# Altium project CM4-Tower.PrjPcb (part 4 of 4)

## Sheet 07_USB_Type-C_DFP_DP_ALT.SchDoc: USB-C Connectors
size A2; Organization: Greenfield Tech Solutions; Address1: Molendreef 33; Address2: Ossendrecht; Address3: 4641CS; Address4: The Netherlands; Revision: 1.1; SheetNumber: 7; SheetTotal: 11
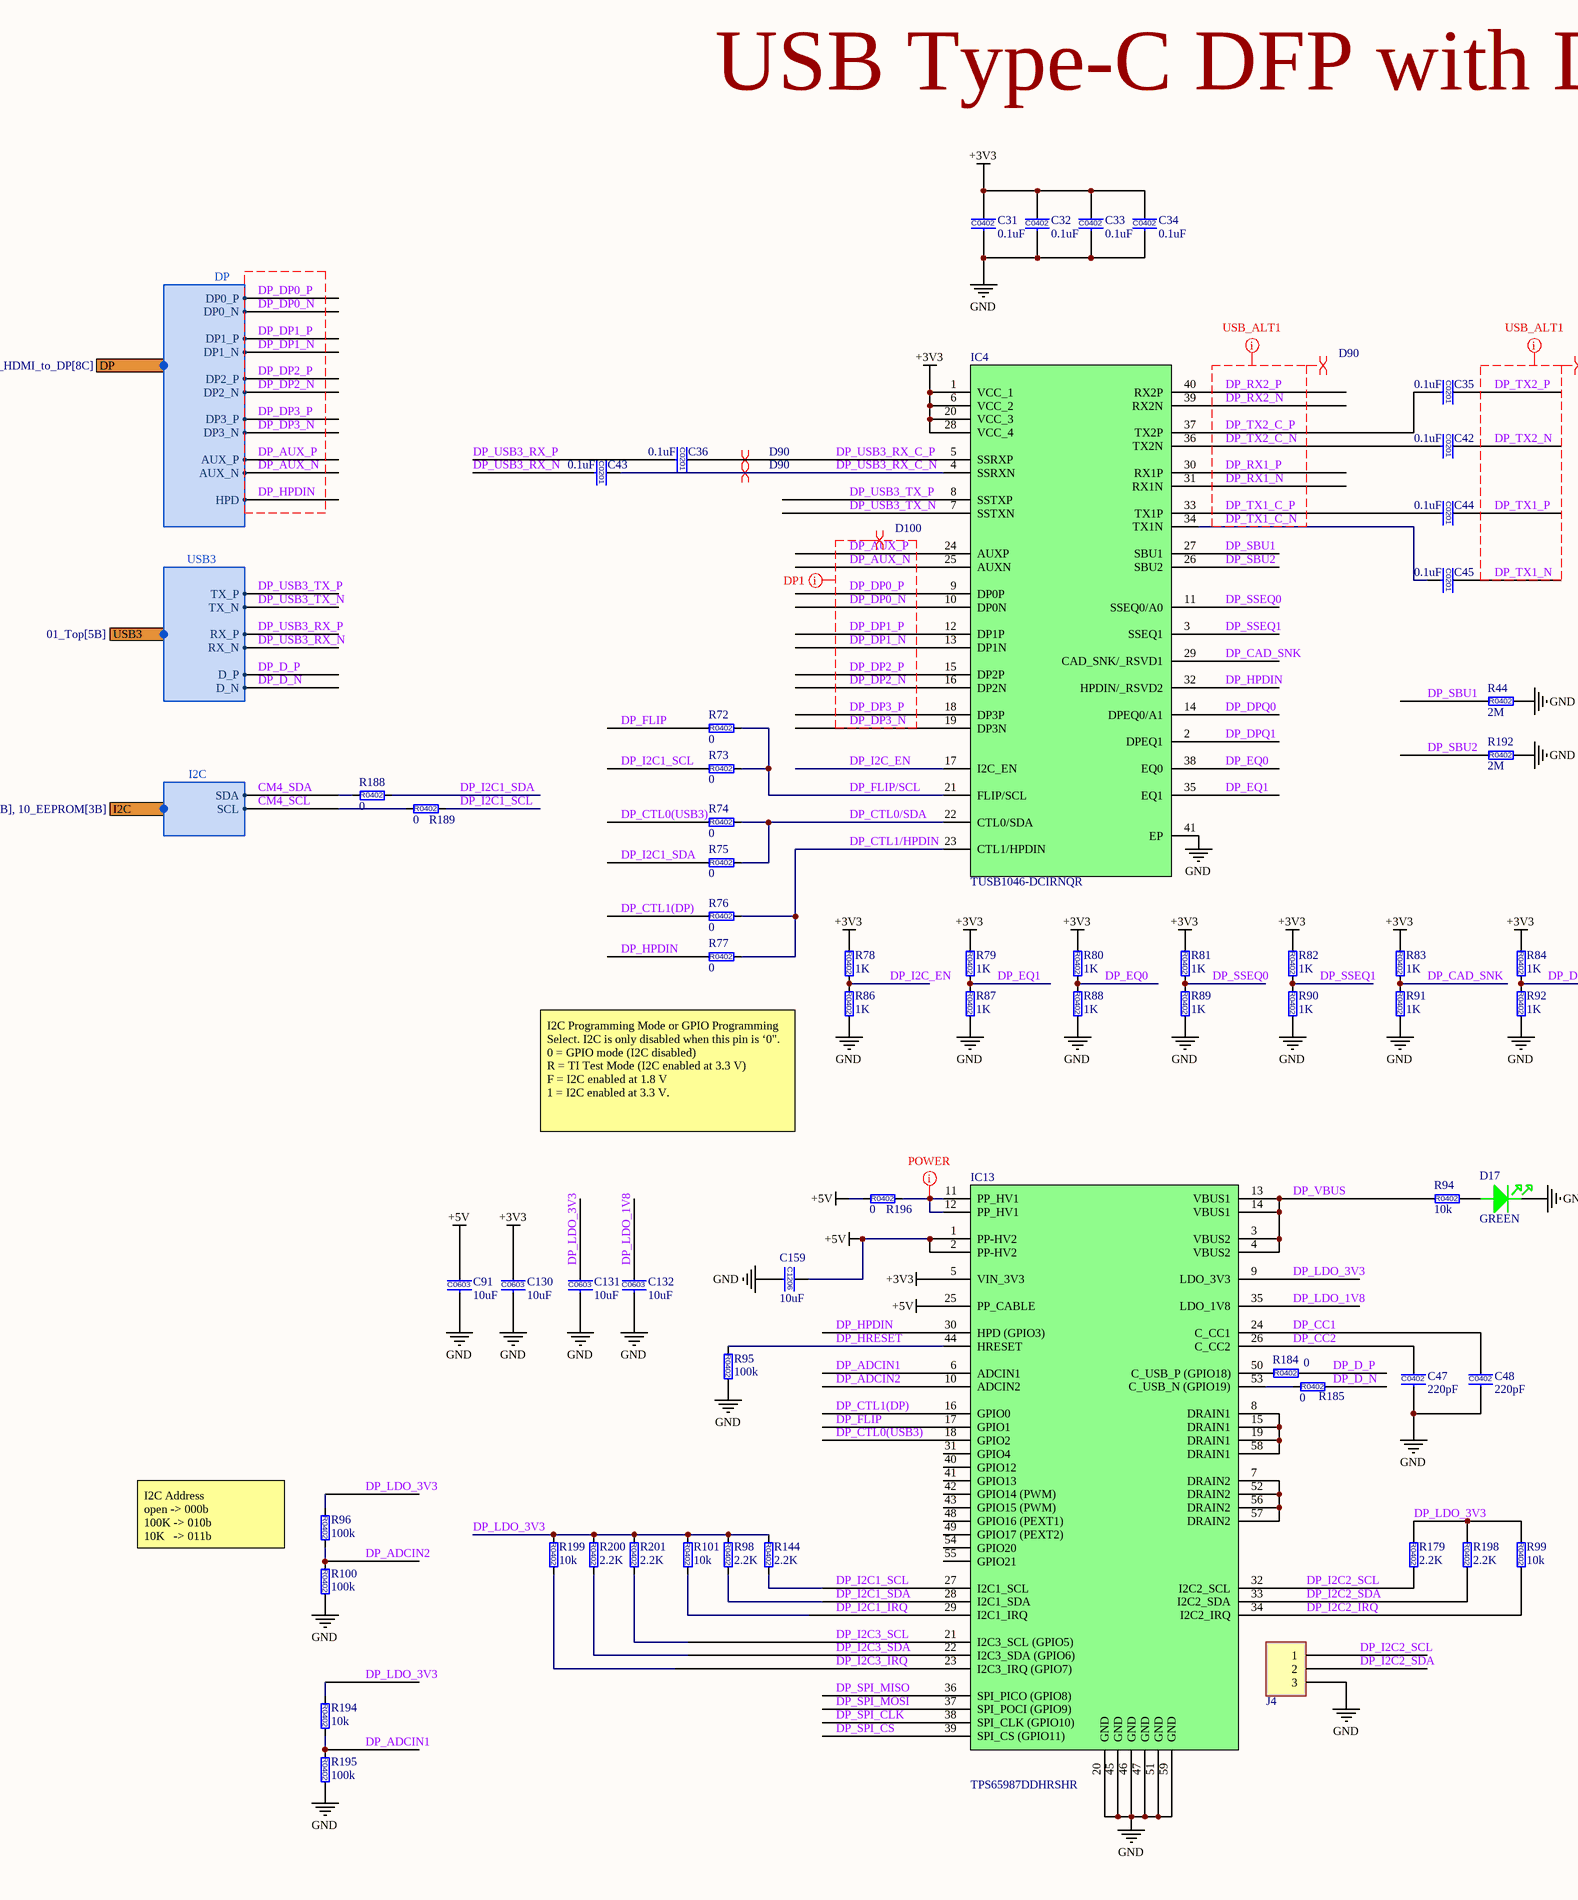
[diagram p12: 07_USB_Type-C_DFP_DP_ALT.SchDoc, left]
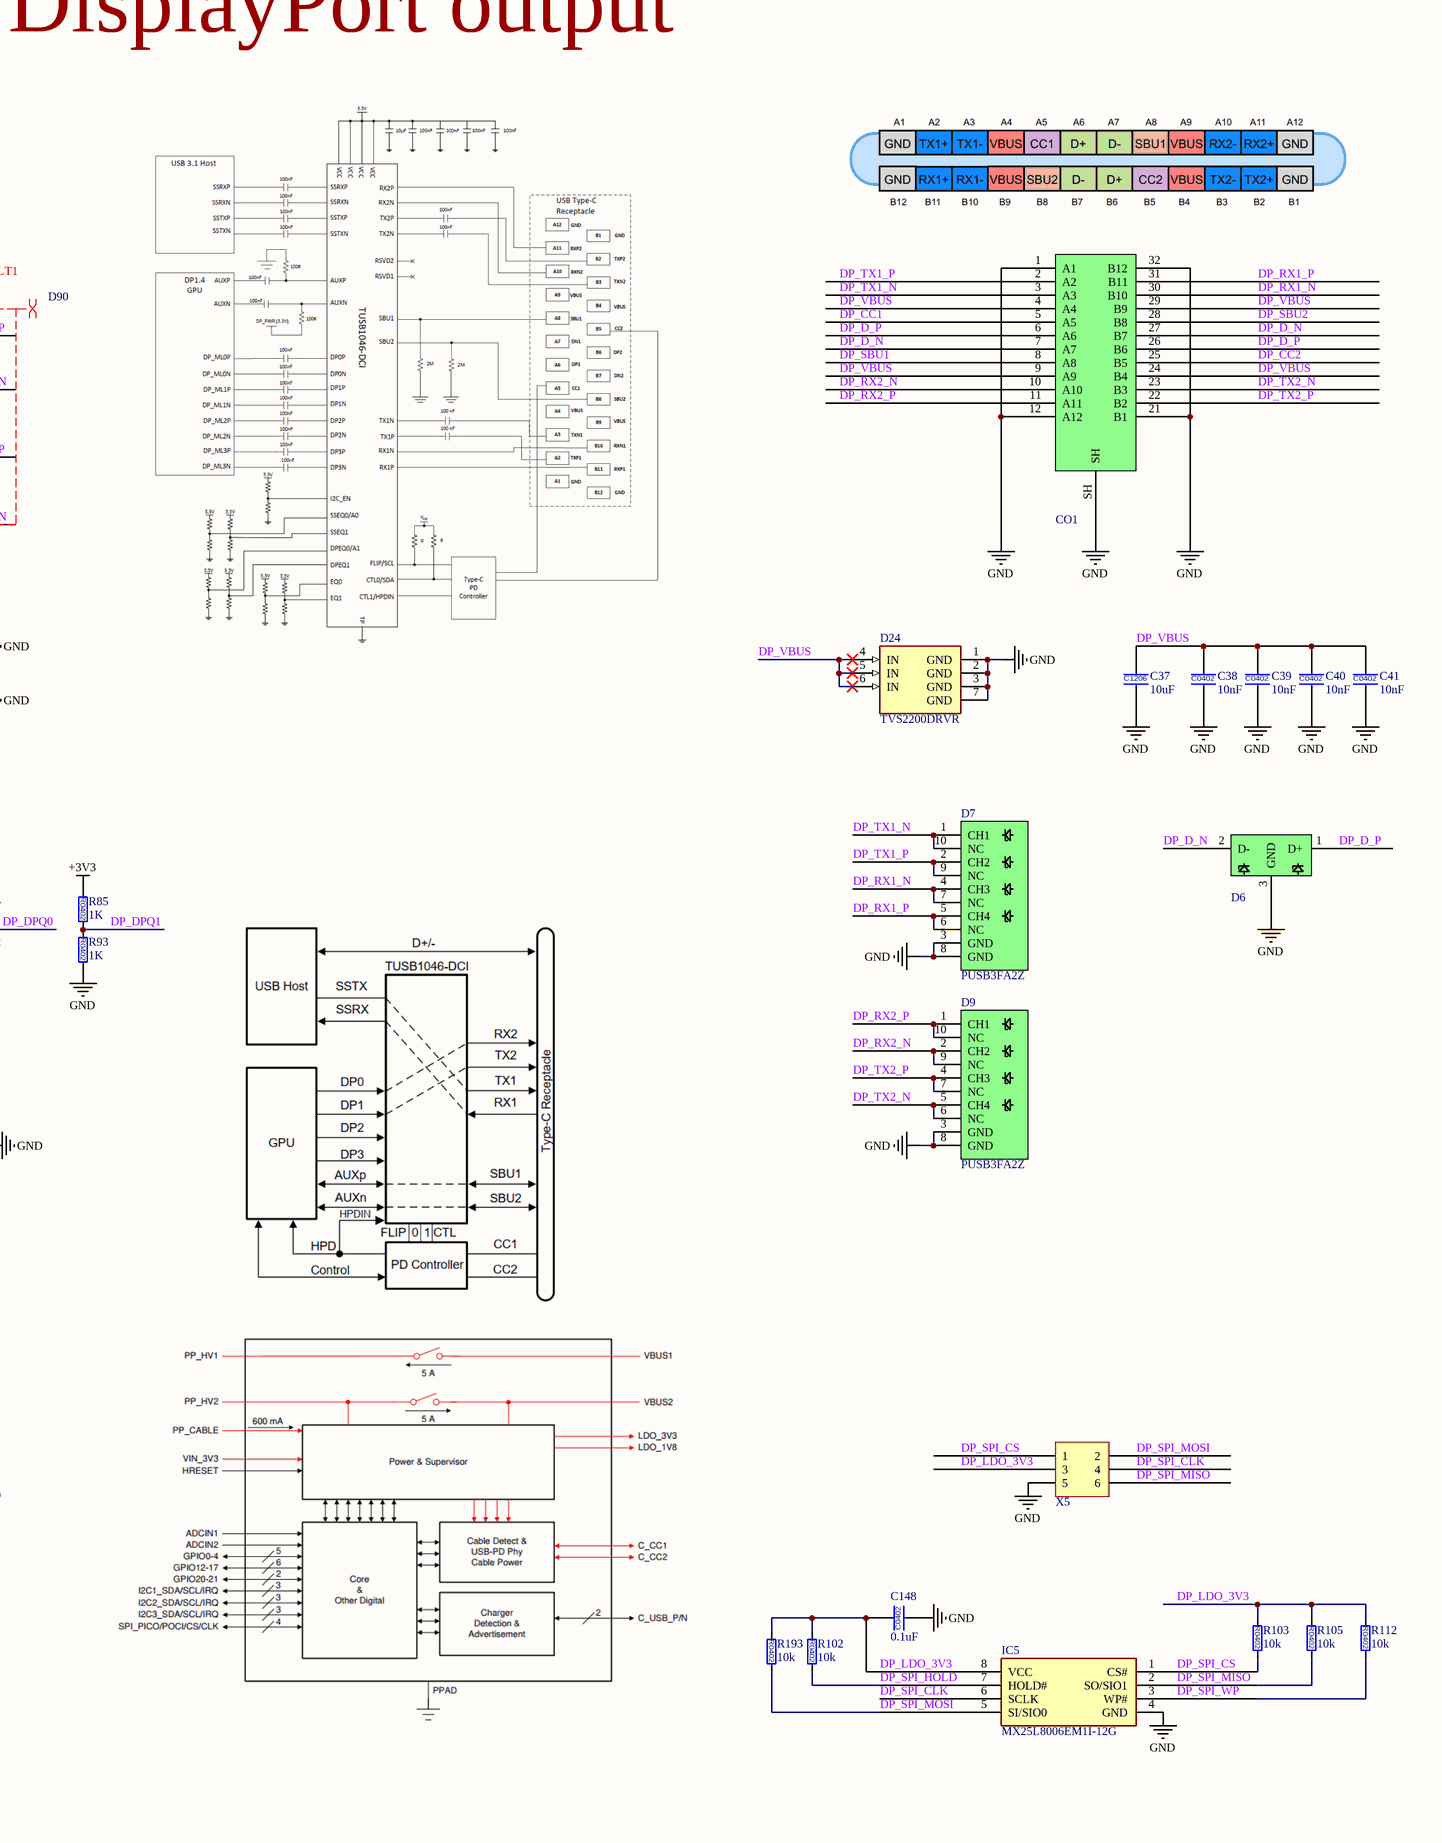
[diagram p13: 07_USB_Type-C_DFP_DP_ALT.SchDoc, right]

### Parts
C31  0.1uF  [C0402]
C32  0.1uF  [C0402]
C33  0.1uF  [C0402]
C34  0.1uF  [C0402]
C35  0.1uF  [C0201]
C36  0.1uF  [C0201]
C37  10uF  [C1206]
C38  10nF  [C0402]
C39  10nF  [C0402]
C40  10nF  [C0402]
C41  10nF  [C0402]
C42  0.1uF  [C0201]
C43  0.1uF  [C0201]
C44  0.1uF  [C0201]
C45  0.1uF  [C0201]
C47  220pF  [C0402]
C48  220pF  [C0402]
C91  10uF  [C0603]
C130  10uF  [C0603]
C131  10uF  [C0603]
C132  10uF  [C0603]
C148  0.1uF  [C0402]
C159  10uF  [C1206]
CO1  USB4070-30-C  [USB4070-30-C]  (value not drawn)
D6  TPD2EUSB30DRTR  [TPD2EUSB30DRTR_SOT-3]  (value not drawn)
D7  PUSB3FA2Z  [PUSB3FA2Z_DFN_2510_10]
D9  PUSB3FA2Z  [PUSB3FA2Z_DFN_2510_10]
D17  GREEN  [LED_0603]
D24  TVS2200DRVR  [TVS2200D_SON_6]
IC4  TUSB1046-DCIRNQR  [TUSB1046_WQFN_40]
IC5  MX25L8006EM1I-12G  [SOIC127P600X175-8N]
IC13  TPS65987DDHRSHR  [TPS65987D_VQFN-56]
J4  PLS-3  [PLS-3-3D]  (value not drawn)
R44  2M  [R0402]
R72  0  [R0402]
R73  0  [R0402]
R74  0  [R0402]
R75  0  [R0402]
R76  0  [R0402]
R77  0  [R0402]
R78  1K  [R0402]
R79  1K  [R0402]
R80  1K  [R0402]
R81  1K  [R0402]
R82  1K  [R0402]
R83  1K  [R0402]
R84  1K  [R0402]
R85  1K  [R0402]
R86  1K  [R0402]
R87  1K  [R0402]
R88  1K  [R0402]
R89  1K  [R0402]
R90  1K  [R0402]
R91  1K  [R0402]
R92  1K  [R0402]
R93  1K  [R0402]
R94  10k  [R0402]
R95  100k  [R0402]
R96  100k  [R0402]
R98  2.2K  [R0402]
R99  10k  [R0402]
R100  100k  [R0402]
R101  10k  [R0402]
R102  10k  [R0402]
R103  10k  [R0402]
R105  10k  [R0402]
R112  10k  [R0402]
R144  2.2K  [R0402]
R179  2.2K  [R0402]
R184  0  [R0402]
R185  0  [R0402]
R188  0  [R0402]
R189  0  [R0402]
R192  2M  [R0402]
R193  10k  [R0402]
R194  10k  [R0402]
R195  100k  [R0402]
R196  0  [R0402]
R198  2.2K  [R0402]
R199  10k  [R0402]
R200  2.2K  [R0402]
R201  2.2K  [R0402]
X5  PBD-6  [PXD-6]  (value not drawn)

### Ports
DP (harness DP, see 01_Top[4B], 05_HDMI_to_DP[8C]), I2C (harness I2C, see 01_Top[4B], 03_RPiCM4[1B], 05_HDMI_to_DP[1B], 06_USB_Type-C_DFP[1B], 08_USB_Type-C_DFP_DP_ALT_buttom[1B], 09_RTC[3B], 10_EEPROM[3B]), USB3 (harness USB3, see 01_Top[5B])

### Harnesses
USB3: TX_P, TX_N, RX_P, RX_N, D_P, D_N
I2C: SDA, SCL
DP: DP0_P, DP1_P, DP1_N, DP0_N, DP3_P, DP3_N, DP2_P, DP2_N, AUX_P, AUX_N, HPD

### Nets
+3V3: C31.1 C32.1 C33.1 C34.1 C130.1 IC4.1(VCC_1) IC4.6(VCC_2) IC4.20(VCC_3) IC4.28(VCC_4) IC13.5(VIN_3V3) R78.1 R79.1 R80.1 R81.1 R82.1 R83.1 R84.1 R85.1
+5V: C91.1 C159.1 IC13.1(PP-HV2) IC13.2(PP-HV2) IC13.25(PP_CABLE) R196.1
GND: C31.2 C32.2 C33.2 C34.2 C37.2 C38.2 C39.2 C40.2 C41.2 C47.2 C48.2 C91.2 C130.2 C131.2 C132.2 C148.2 C159.2 CO1.1(A1) CO1.12(A12) CO1.21(B1) CO1.32(B12) CO1.SH D6.3(GND) D7.3(GND) D7.8(GND) D9.3(GND) D9.8(GND) D17.1(Cathode) D24.1(GND) D24.2(GND) D24.3(GND) D24.7(GND) IC4.41(EP) IC5.4(GND) IC13.20(GND) IC13.45(GND) IC13.46(GND) IC13.47(GND) IC13.51(GND) IC13.59(GND) J4.3 R44.2 R86.2 R87.2 R88.2 R89.2 R90.2 R91.2 R92.2 R93.2 R95.2 R100.2 R192.2 R195.2 X5.5
CM4_SCL: R189.1 ; port I2C.SCL  [project net CM4_I2C.SCL]
CM4_SDA: R188.1 ; port I2C.SDA  [project net CM4_I2C.SDA]
DP_ADCIN1: IC13.6(ADCIN1) R194.2 R195.1
DP_ADCIN2: IC13.10(ADCIN2) R96.2 R100.1
DP_AUX_N: IC4.25(AUXN) ; port DP.AUX_N  [project net AUX_N]
DP_AUX_P: IC4.24(AUXP) ; port DP.AUX_P  [project net AUX_P]
DP_CAD_SNK: IC4.29(CAD_SNK/_RSVD1) R83.2 R91.1
DP_CC1: C48.1 CO1.5(A5) IC13.24(C_CC1)
DP_CC2: C47.1 CO1.25(B5) IC13.26(C_CC2)
DP_CTL0(USB3): IC13.18(GPIO2) R74.1
DP_CTL0/SDA: IC4.22(CTL0/SDA) R74.2 R75.2
DP_CTL1(DP): IC13.16(GPIO0) R76.1
DP_CTL1/HPDIN: IC4.23(CTL1/HPDIN) R76.2 R77.2
DP_D_N: CO1.7(A7) CO1.27(B7) D6.2(D-) R185.2 ; port USB3.D_N
DP_D_P: CO1.6(A6) CO1.26(B6) D6.1(D+) R184.2 ; port USB3.D_P
DP_DP0_N: IC4.10(DP0N) ; port DP.DP0_N  [project net DP0_N]
DP_DP0_P: IC4.9(DP0P) ; port DP.DP0_P  [project net DP0_P]
DP_DP1_N: IC4.13(DP1N) ; port DP.DP1_N  [project net DP1_N]
DP_DP1_P: IC4.12(DP1P) ; port DP.DP1_P  [project net DP1_P]
DP_DP2_N: IC4.16(DP2N) ; port DP.DP2_N  [project net DP2_N]
DP_DP2_P: IC4.15(DP2P) ; port DP.DP2_P  [project net DP2_P]
DP_DP3_N: IC4.19(DP3N) ; port DP.DP3_N  [project net DP3_N]
DP_DP3_P: IC4.18(DP3P) ; port DP.DP3_P  [project net DP3_P]
DP_DPQ0: IC4.14(DPEQ0/A1) R84.2 R92.1
DP_DPQ1: IC4.2(DPEQ1) R85.2 R93.1
DP_EQ0: IC4.38(EQ0) R80.2 R88.1
DP_EQ1: IC4.35(EQ1) R79.2 R87.1
DP_FLIP: IC13.17(GPIO1) R72.1
DP_FLIP/SCL: IC4.21(FLIP/SCL) R72.2 R73.2
DP_HPDIN: IC4.32(HPDIN/_RSVD2) IC13.30(HPD_(GPIO3)) R77.1 ; port DP.HPD  [project net DP_HPD]
DP_HRESET: IC13.44(HRESET) R95.1
DP_I2C1_IRQ: IC13.29(I2C1_IRQ) R101.2
DP_I2C1_SCL: IC13.27(I2C1_SCL) R73.1 R144.2 R189.2
DP_I2C1_SDA: IC13.28(I2C1_SDA) R75.1 R98.2 R188.2
DP_I2C2_IRQ: IC13.34(I2C2_IRQ) R99.2
DP_I2C2_SCL: IC13.32(I2C2_SCL) J4.1 R179.2
DP_I2C2_SDA: IC13.33(I2C2_SDA) J4.2 R198.2
DP_I2C3_IRQ: IC13.23(I2C3_IRQ_(GPIO7)) R199.2
DP_I2C3_SCL: IC13.21(I2C3_SCL_(GPIO5)) R201.2
DP_I2C3_SDA: IC13.22(I2C3_SDA_(GPIO6)) R200.2
DP_I2C_EN: IC4.17(I2C_EN) R78.2 R86.1
DP_LDO_1V8: C132.1 IC13.35(LDO_1V8)
DP_LDO_3V3: C131.1 C148.1 IC5.8(VCC) IC13.9(LDO_3V3) R96.1 R98.1 R99.1 R101.1 R102.1 R103.1 R105.1 R112.1 R144.1 R179.1 R193.1 R194.1 R198.1 R199.1 R200.1 R201.1 X5.3
DP_RX1_N: CO1.30(B10) D7.4(CH3) D7.7(NC) IC4.31(RX1N)
DP_RX1_P: CO1.31(B11) D7.5(CH4) D7.6(NC) IC4.30(RX1P)
DP_RX2_N: CO1.10(A10) D9.2(CH2) D9.9(NC) IC4.39(RX2N)
DP_RX2_P: CO1.11(A11) D9.1(CH1) D9.10(NC) IC4.40(RX2P)
DP_SBU1: CO1.8(A8) IC4.27(SBU1) R44.1
DP_SBU2: CO1.28(B8) IC4.26(SBU2) R192.1
DP_SPI_CLK: IC5.6(SCLK) IC13.38(SPI_CLK_(GPIO10)) X5.4
DP_SPI_CS: IC5.1(CS#) IC13.39(SPI_CS_(GPIO11)) R103.2 X5.1
DP_SPI_HOLD: IC5.7(HOLD#) R102.2
DP_SPI_MISO: IC5.2(SO/SIO1) IC13.36(SPI_PICO_(GPIO8)) R105.2 X5.6
DP_SPI_MOSI: IC5.5(SI/SIO0) IC13.37(SPI_POCI_(GPIO9)) R193.2 X5.2
DP_SPI_WP: IC5.3(WP#) R112.2
DP_SSEQ0: IC4.11(SSEQ0/A0) R81.2 R89.1
DP_SSEQ1: IC4.3(SSEQ1) R82.2 R90.1
DP_TX1_C_N: C45.2 IC4.34(TX1N)
DP_TX1_C_P: C44.2 IC4.33(TX1P)
DP_TX1_N: C45.1 CO1.3(A3) D7.1(CH1) D7.10(NC)
DP_TX1_P: C44.1 CO1.2(A2) D7.2(CH2) D7.9(NC)
DP_TX2_C_N: C42.2 IC4.36(TX2N)
DP_TX2_C_P: C35.2 IC4.37(TX2P)
DP_TX2_N: C42.1 CO1.23(B3) D9.5(CH4) D9.6(NC)
DP_TX2_P: C35.1 CO1.22(B2) D9.4(CH3) D9.7(NC)
DP_USB3_RX_C_N: C43.1 IC4.4(SSRXN)
DP_USB3_RX_C_P: C36.1 IC4.5(SSRXP)
DP_USB3_RX_N: C43.2 ; port USB3.RX_N
DP_USB3_RX_P: C36.2 ; port USB3.RX_P
DP_USB3_TX_N: IC4.7(SSTXN) ; port USB3.TX_N
DP_USB3_TX_P: IC4.8(SSTXP) ; port USB3.TX_P
DP_VBUS: C37.1 C38.1 C39.1 C40.1 C41.1 CO1.4(A4) CO1.9(A9) CO1.24(B4) CO1.29(B9) D24.4(IN) D24.5(IN) D24.6(IN) IC13.3(VBUS2) IC13.4(VBUS2) IC13.13(VBUS1) IC13.14(VBUS1) R94.1
NetD17_2: D17.2(Anode) R94.2
NetIC13_7: IC13.7(DRAIN2) IC13.52(DRAIN2) IC13.56(DRAIN2) IC13.57(DRAIN2)
NetIC13_8: IC13.8(DRAIN1) IC13.15(DRAIN1) IC13.19(DRAIN1) IC13.58(DRAIN1)
NetIC13_11: IC13.11(PP_HV1) IC13.12(PP_HV1) R196.2
NetIC13_50: IC13.50(C_USB_P_(GPIO18)) R184.1
NetIC13_53: IC13.53(C_USB_N_(GPIO19)) R185.1

Not connected (* = marked no-connect by the designer): IC13 31(GPIO4) 40(GPIO12) 41(GPIO13) 42(GPIO14_(PWM)) 43(GPIO15_(PWM)) 48(GPIO16_(PEXT1)) 49(GPIO17_(PEXT2)) 54(GPIO20) 55(GPIO21)

### Layout directives
differential pair; differential pair class D100: DP_AUX_N, DP_AUX_P, DP_DP0_N, DP_DP0_P, DP_DP1_N, DP_DP1_P, DP_DP2_N, DP_DP2_P, DP_DP3_N, DP_DP3_P
net class DP1: DP_AUX_N, DP_AUX_P, DP_DP0_N, DP_DP0_P, DP_DP1_N, DP_DP1_P, DP_DP2_N, DP_DP2_P, DP_DP3_N, DP_DP3_P
differential pair; differential pair class D90: DP_RX1_N, DP_RX1_P, DP_RX2_N, DP_RX2_P, DP_TX1_C_N, DP_TX1_C_P, DP_TX1_N, DP_TX1_P, DP_TX2_C_N, DP_TX2_C_P, DP_TX2_N, DP_TX2_P, DP_USB3_RX_C_N, DP_USB3_RX_C_P
net class USB_ALT1: DP_RX1_N, DP_RX1_P, DP_RX2_N, DP_RX2_P, DP_TX1_C_N, DP_TX1_C_P, DP_TX1_N, DP_TX1_P, DP_TX2_C_N, DP_TX2_C_P, DP_TX2_N, DP_TX2_P
net class POWER: NetIC13_11

### Notes on the sheet
- USB Type-C DFP with DisplayPort output
- I2C Programming Mode or GPIO Programming Select. I2C is only disabled when this pin is ‘0".
  0 = GPIO mode (I2C disabled)
  R = TI Test Mode (I2C enabled at 3.3 V)
  F = I2C enabled at 1.8 V
  1 = I2C enabled at 3.3 V.
- I2C Address
  open -> 000b
  100K -> 010b
  10K   -> 011b
- Title
- Size:
- Date:
- File:
- A2
- Number:
- Time:
- Revision:
- Sheet
- of
- (in symbol 0603ZD106KAT2A) C0603
- (in symbol 02016D104KAT) C0201
- (in symbol 04023A221JAT4A) C0402
- (in symbol 04023D104KAT2A) C0402
- (in symbol 04025C103JAT2A) C0402
- (in symbol 12065D106KAT4A) C1206
- (in symbol CRCW04021K00FKEDC) R0402
- (in symbol CRCW04022K20FK) R0402
- (in symbol CRCW04022M00FKEDC) R0402
- (in symbol CRCW040210K0FK) R0402
- (in symbol CRCW0402100KFKEDC) R0402
- (in symbol CRCW04020000Z0) R0402

### Library data of the parts
C31-C34 C148 = 04023D104KAT2A: as C10-C12 on sheet 04_PCIe_VL805; Manufacturer Part Number: 04023D104KAT2A; Value: 0.1uF; Voltage - Rated: 25V; Tolerance: ±10%; Temperature Coefficient: X5R
C35 C36 C42-C45 = 02016D104KAT: CAP CER  0.1uF 10% 6.3V X5R 0201; Manufacturer: AVX Corporation; Capacitance: 100nF; Category: Capacitors; Manufacturer Part Number: 02016D104KAT; Operating Temperature: -55°C ~ 85°C; Package / Case: 0201; Value: 0.1uF; Voltage - Rated: 6.3V; Supplier: Digi-Key; Tolerance: ±10%; Temperature Coefficient: X5R; Mounting Type: Surface Mount, MLCC
C37 C159 = 12065D106KAT4A: CAP CER  10uF 10% 50V X5R 1206; Manufacturer: KYOCERA AVX; Value: 10µF; check: ok; Manufacturer Part Number: 12065D106KAT4A; Tolerance: ±10%; Voltage - Rated: 50V; Temperature Coefficient: X5R
C38-C41 = 04025C103JAT2A: CAP CER 10nF 5% 50V X7R 0402; Manufacturer: KYOCERA AVX; Manufacturer Part Number: 04025C103JAT2A; Operating Temperature: -55°C ~ 125°C; Package / Case: 0402 (1005 Metric); Value: 10nF; Voltage - Rated: 50V; Tolerance: ±5%; Temperature Coefficient: X7R
C47 C48 = 04023A221JAT4A: CAP CER  220pF 5% 25V NP0 0402; Manufacturer: KYOCERA AVX; Manufacturer Part Number: 04023A221JAT4A; Operating Temperature: -55°C ~ 125°C; Package / Case: 0402; Value: 220pF; Voltage - Rated: 25V; Tolerance: ±5%; Temperature Coefficient: NP0
C91 C130-C132 = 0603ZD106KAT2A: CAP CER 10uF 10% 10V X5R 0603; Manufacturer: KYOCERA AVX; Value: 10µF; Manufacturer Part Number: 0603ZD106KAT2A; Tolerance: ±10%; Voltage - Rated: 10V; Temperature Coefficient: X5R
CO1 = USB4070-30-C: 24 Position 20 VDC USB Type C Horizontal USB 3.1 Receptacle Connector; Part Number: CO0021; Manufacturer: Global Connector Technology; ID: 16; USB Standard: USB 3.1; Number of Contacts: 24; Number of Ports: 1; Mating Cycles: 10000; Shielding: Shielded; ManfactPart: USB4070-30-C; Supplier 1: Farnell; Manufacturer Part Number: USB4070-30-C; RoHS: No; Category: USB Connectors; Stock 1: 87; Pricing 1: 1=3.37000, 10=2.90000, 30=2.83000, 80=2.69000, 200=2.64000 (GBP); Mount: Surface Mount,Through Hole,Vertical; Contact Material: Copper Alloy; Contact Plating: Gold; Insulation Color: Black; Min Operating Temperature: -40°C; Max Operating Temperature: 85°C; Gender: Receptacle; Orientation: Vertical; Connector Type: USB; Series: USB4070; Packaging: Tape and Reel; Termination: Solder; Reach SVHC Compliant: Yes; Lead Free: Lead Free; Flammability Rating: UL94 V-0; ComponentLink1URL: http://www.farnell.com/datasheets/2342947.pdf?src-supplier=Farnell; ComponentLink1Description: http://www.farnell.com/datasheets/2342947.pdf?src-supplier=Farnell; ComponentLink2URL: http://www.farnell.com/cad/2113628.pdf?src-supplier=Element14; ComponentLink2Description: http://www.farnell.com/cad/2113628.pdf?src-supplier=Element14; ComponentLink3URL: http://www.farnell.com/datasheets/2342947.pdf?src-supplier=Newark; ComponentLink3Description: http://www.farnell.com/datasheets/2342947.pdf?src-supplier=Newark; RefVal: USB4070; Supplier Part Number 1: 2784985
D6 = TPD2EUSB30DRTR: Dual 0.7-pF, 5.5-V ±8-kV ESD protection diode with 5-A surge rating for USB 3.0 3-SOT-9X3 -40 to 85; Manufacturer: Texas Instruments; Direction: Bidirectional,Unidirectional; Capacitance: 0.8pF; Number of Bidirectional Channels: 2; Reverse Standoff Voltage: 5.5V; Min Breakdown Voltage: 9V; Clamping Voltage: 8V; Peak Pulse Power: 45W; Power Line Protection: Yes; Test Current: 1mA; Peak Pulse Current: 1A; Supplier 1: Mouser; Manufacturer Part Number: TPD2EUSB30DRTR; RoHS: Yes; Category: Integrated Circuits (ICs); Pricing 1: 1=0.66000, 10=0.56100, 50=0.56000, 100=0.41900, 1000=0.25500, 10000=0.23100 (USD); Case/Package: SOT; Number of Pins: 3; Min Operating Temperature: -40°C; Max Operating Temperature: 85°C; Packaging: Tape and Reel; Package Quantity: 1; Breakdown Voltage: 9V; Number of Channels: 2; Working Voltage: 5.5V; ESD Protection: Yes; Element Configuration: Dual; Interface: USB; Series: -; Number of Unidirectional Channels: 2; Length: 1mm; Width: 0.85mm; Height: 0.45mm; Depth: 0.8mm; Radiation Hardening: No; Reach SVHC Compliant: Yes; Lead Free: Lead Free; RoHS Compliant: Yes; ComponentLink1URL: https://datasheet.ciiva.com/1611/tpd2eusb30-1611602.pdf?src-supplier=Newark; ComponentLink1Description: https://datasheet.ciiva.com/1611/tpd2eusb30-1611602.pdf?src-supplier=Newark; ComponentLink2URL: https://datasheet.ciiva.com/15134/getdatasheetpartid-202713-15134479.pdf?src-supplier=Verical; ComponentLink2Description: https://datasheet.ciiva.com/15134/getdatasheetpartid-202713-15134479.pdf?src-supplier=Verical; ComponentLink3URL: https://datasheet.ciiva.com/1504/1882087-1504248.pdf?src-supplier=Element14; ComponentLink3Description: https://datasheet.ciiva.com/1504/1882087-1504248.pdf?src-supplier=Element14; ComponentLink4URL: https://datasheet.ciiva.com/353/tpd2eusb30-353273.pdf?src-supplier=Digi-Key; ComponentLink4Description: https://datasheet.ciiva.com/353/tpd2eusb30-353273.pdf?src-supplier=Digi-Key; ComponentLink5URL: https://datasheet.ciiva.com/353/tpd2eusb30-353272.pdf?src-supplier=Digi-Key; ComponentLink5Description: https://datasheet.ciiva.com/353/tpd2eusb30-353272.pdf?src-supplier=Digi-Key; ComponentLink6URL: https://datasheet.ciiva.com/353/tpd2eusb30-353274.pdf?src-supplier=Digi-Key; ComponentLink6Description: https://datasheet.ciiva.com/353/tpd2eusb30-353274.pdf?src-supplier=Digi-Key; Supplier Part Number 1: 595-TPD2EUSB30DRTR
D7 D9 = PUSB3FA2Z: PUSB3FA2/SOT1176/XSON10; Part Number: DI0007; Manufacturer: Nexperia; ID: 7; RefVal: TVS; ManfactPart: PUSB3FA2Z; Supplier 1: Digi-Key; Manufacturer Part Number: PUSB3FA2Z; RoHS: No; Category: TVS Diodes; Stock 1: 8565; Pricing 1: 1=0.39000, 10=0.31700, 100=0.21570, 500=0.16178, 1000=0.12134, 2000=0.11123 (USD); ComponentLink1URL: http://www.farnell.com/datasheets/2621625.pdf?src-supplier=Farnell; ComponentLink1Description: http://www.farnell.com/datasheets/2621625.pdf?src-supplier=Farnell; ComponentLink2URL: https://assets.nexperia.com/documents/data-sheet/PUSB3FA2.pdf?src-supplier=Digi-Key; ComponentLink2Description: https://assets.nexperia.com/documents/data-sheet/PUSB3FA2.pdf?src-supplier=Digi-Key; ComponentLink3URL: http://www.farnell.com/datasheets/2621625.pdf?src-supplier=Newark; ComponentLink3Description: http://www.farnell.com/datasheets/2621625.pdf?src-supplier=Newark; Supplier Part Number 1: 1727-7813-1-ND; Supplier 2: Farnell; Stock 2: 8440; Pricing 2: 5=0.31600, 10=0.25800, 100=0.17600, 500=0.13300, 1000=0.11400, 5000=0.09420 (GBP); Supplier 3: Digi-Key; Stock 3: 5000; Pricing 3: 5000=0.10449, 10000=0.09774, 25000=0.09450 (USD); Supplier Part Number 3: 1727-7813-2-ND; Supplier Part Number 2: 2901054
D17 = LED_SMD_0603_GREEN: LED Uni-Color Yellow Green 574nm 2-Pin Chip 0603(1608Metric) T/R; Manufacturer: Vishay Semiconductors; Manufacturer Part Number: VLMG1300-GS08; Color: Green,Yellow; Forward Voltage: 2V; Forward Current: 20mA; Lens Style: Rectangular,Clear; Luminous Intensity: 35mcd; Number of LEDs: 1; Viewing Angle: 130°; Dominant Wavelength: 571nm; Power Dissipation: 75mW; Reverse Voltage: 5V; Supplier 1: Farnell; RoHS: Yes; Category: LEDs; Stock 1: 18400; Pricing 1: 5=0.31000, 10=0.23700, 100=0.10900, 500=0.09900 (EUR); Mount: Surface Mount; Case/Package: 0603; Number of Pins: 2; Case Code (Metric): 1608; Case Code (Imperial): 0603; Min Operating Temperature: -35°C; Max Operating Temperature: 85°C; Packaging: Tape and Reel; Package Quantity: 1; Series: CHipLED; Illumination Color: Green,Yellow; Wavelength: 571nm; Test Current: 20mA; Number of Elements: 1; Power Rating: 75mW; Length: 1.6mm; Width: 0.8mm; Height: 0.8mm; Depth: 0.8mm; Radiation Hardening: No; RoHS Compliant: Yes; Lead Free: Lead Free; ComponentLink1URL: https://datasheet.ciiva.com/8028/vlmo1300-8028023.pdf?src-supplier=Element14; ComponentLink1Description: https://datasheet.ciiva.com/8028/vlmo1300-8028023.pdf?src-supplier=Element14; ComponentLink2URL: https://datasheet.ciiva.com/2114/vlmo1300-2114971.pdf?src-supplier=Digi-Key; ComponentLink2Description: https://datasheet.ciiva.com/2114/vlmo1300-2114971.pdf?src-supplier=Digi-Key; ComponentLink3URL: https://datasheet.ciiva.com/26322/vlmo1300-26322139.pdf?src-supplier=Element14; ComponentLink3Description: https://datasheet.ciiva.com/26322/vlmo1300-26322139.pdf?src-supplier=Element14; ComponentLink4URL: https://datasheet.ciiva.com/2114/vlmo1300-2114972.pdf?src-supplier=Digi-Key; ComponentLink4Description: https://datasheet.ciiva.com/2114/vlmo1300-2114972.pdf?src-supplier=Digi-Key; ComponentLink5URL: https://datasheet.ciiva.com/26322/vlmo1300-26322140.pdf?src-supplier=Element14; ComponentLink5Description: https://datasheet.ciiva.com/26322/vlmo1300-26322140.pdf?src-supplier=Element14; ComponentLink6URL: https://datasheet.ciiva.com/2114/vlmo1300-2114973.pdf?src-supplier=Digi-Key; ComponentLink6Description: https://datasheet.ciiva.com/2114/vlmo1300-2114973.pdf?src-supplier=Digi-Key; ComponentLink7URL: https://datasheet.ciiva.com/9333/vlmo1300-9333390.pdf?src-supplier=Avnet; ComponentLink7Description: https://datasheet.ciiva.com/9333/vlmo1300-9333390.pdf?src-supplier=Avnet; Supplier Part Number 1: 2251461
D24 = TVS2200DRVR: 22-V flat-clamp surge protection device 6-WSON -40 to 125; Manufacturer: Texas Instruments; Reverse Standoff Voltage: 22V; Standoff Height: 0mm; Clamping Voltage: 27.7V; Number Of Channels: 1; Capacitance: 105pF; Value: 105pF; Direction: Unidirectional; Breakdown Voltage: 24.6V; Peak Pulse Current: 40A; Package: DRV0006A; Category: Diode; Device Class L3: unset; Device Class L1: Circuit Protection; Temperature: -40°C to +125°C; ComponentLink2Description: Datasheet; Height: 0.8mm; Ambient Temperature Range Low: -40°C; Octopart: https://octopart.com/tvs2200drvr-texas+instruments-88217346; Temperature Range High: +125°C; Automotive: No; Temperature Range Low: -40°C; Ipc Land Pattern Name: DFN200X200X75-6; Manufacturer Part Number: TVS2200DRVR; Device Class L2: ESD and Circuit Protection ICs; RoHS: TRUE; Lead Free: Yes; Ambient Temperature Range High: +125°C; Mouser Description: Diode TVS Single Uni-Dir 22V 1.12KW 6-Pin WSON EP T/R; ComponentLink2URL: http://www.ti.com/lit/ds/symlink/tvs2200.pdf; Digikey Description: UNIDIR PRECISION SURGE DIODE; Supplier 1: Mouser; Pricing 1: 1=0.56000, 10=0.47800, 50=0.44600, 100=0.35700, 1000=0.21700, 10000=0.19700 (USD); Mount: Surface Mount; Min Operating Temperature: -40°C; Max Operating Temperature: 125°C; Packaging: Tape and Reel; Number of Circuits: 1; RoHS Compliant: Yes; ComponentLink1URL: http://www.ti.com/lit/ds/symlink/tvs2200.pdf?src-supplier=Digi-Key; ComponentLink1Description: http://www.ti.com/lit/ds/symlink/tvs2200.pdf?src-supplier=Digi-Key; ComponentLink3URL: http://www.ti.com/general/docs/suppproductinfo.tsp?distId=10&amp;gotoUrl=http%3A%2F%2Fwww.ti.com%2Flit%2Fgpn%2Ftvs2200&src-supplier=Digi-Key; ComponentLink3Description: http://www.ti.com/general/docs/suppproductinfo.tsp?distId=10&amp;gotoUrl=http%3A%2F%2Fwww.ti.com%2Flit%2Fgpn%2Ftvs2200&src-supplier=Digi-Key; Supplier Part Number 1: 595-TVS2200DRVR
IC4 = TUSB1046-DCIRNQR: USB Type-C™ DP ALT Mode 10-Gbps linear redriver crosspoint switch for source side 40-WQFN -40 to 85; Manufacturer: Texas Instruments; Manufacturer Part Number: TUSB1046AI-DCIRNQR; Number of Channels: 4; On-State Resistance: 10R; Datasheet Link: https://www.ti.com/lit/ds/symlink/tusb1046-dci.pdf?ts=1635509425736&ref_url=https%253A%252F%252Fwww.google.com%252F; Height: 0.8mm; Mouser Part Number: 595-TUSB1046-DCIRNQR; Mouser Price/Stock: https://www.mouser.co.uk/ProductDetail/Texas-Instruments/TUSB1046-DCIRNQR?qs=Euq2YPj5ArLS2CQihiHSYg%3D%3D; Arrow Part Number: TUSB1046-DCIRNQR; Arrow Price/Stock: https://www.arrow.com/en/products/tusb1046-dcirnqr/texas-instruments; Supplier 1: Mouser; RoHS: Yes; Category: Integrated Circuits (ICs); Pricing 1: 1=9.42000, 10=8.51000, 50=8.12000, 100=7.05000, 1000=5.75000, 10000=5.74000 (USD); Min Operating Temperature: -40°C; Max Operating Temperature: 85°C; RoHS Compliant: Yes; ComponentLink1URL: http://www.ti.com/lit/ds/symlink/tusb1046a-dci.pdf?src-supplier=Digi-Key; ComponentLink1Description: http://www.ti.com/lit/ds/symlink/tusb1046a-dci.pdf?src-supplier=Digi-Key; Supplier Part Number 1: 595-USB1046AIDCIRNQR
IC5 = MX25L8006EM1I-12G: NOR Flash Serial 3.3V 8M-bit 8M/4M x 1/2-bit 8ns 8-Pin SOP / IC FLASH 8MBIT 86MHZ 8SOP; Manufacturer_Name: Macronix; Operating Supply Voltage: 3.6V; Density: 8Mb; Interface: SPI,Serial; Memory Type: FLASH,NOR; Datasheet Link: https://www.mxic.com.tw/Lists/Datasheet/Attachments/7445/MX25L8006E,%203V,%208Mb,%20v1.6.pdf; Height: 1.75mm; Manufacturer_Part_Number: MX25L8006EM1I-12G; Arrow Part Number: MX25L8006EM1I-12G; Arrow Price/Stock: https://www.arrow.com/en/products/mx25l8006em1i-12g/macronix-international?region=nac; Supplier 1: Digi-Key; Manufacturer: Macronix; Manufacturer Part Number: MX25L8006EM1I-12G; RoHS: Yes; Category: Flash; Stock 1: 66203; Pricing 1: 1=0.58000, 10=0.52500, 25=0.51880, 50=0.51580, 100=0.46120, 250=0.45736, 500=0.45058, 1000=0.43446, 5000=0.39572 (USD); Case/Package: SOIC; Min Operating Temperature: -40°C; Max Operating Temperature: 85°C; Max Frequency: 86MHz; Package Quantity: 98; Packaging: Rail/Tube; Frequency: 86MHz; Series: MX25xxx05/06; Supply Voltage-Nom: 3.6V; Lead Free: Lead Free; Temperature Grade: INDUSTRIAL; RoHS Compliant: Yes; ComponentLink1URL: http://ckassoc.com/oldsite/pdf/Macronix_Product_Line_Card_July_2017_General%20_070617.pdf?src-supplier=Digi-Key; ComponentLink1Description: http://ckassoc.com/oldsite/pdf/Macronix_Product_Line_Card_July_2017_General%20_070617.pdf?src-supplier=Digi-Key; ComponentLink2URL: http://www.macronix.com/QuickPlace/hq/PageLibrary4825740B00298A3B.nsf/h_Index/3F21BAC2E121E17848257639003A3146/$File/MX25L8006E,%203V,%208Mb,%20v1.3.pdf?src-supplier=Future+Electronics; ComponentLink2Description: http://www.macronix.com/QuickPlace/hq/PageLibrary4825740B00298A3B.nsf/h_Index/3F21BAC2E121E17848257639003A3146/$File/MX25L8006E,%203V,%208Mb,%20v1.3.pdf?src-supplier=Future+Electronics; Supplier Part Number 1: 1092-1117-ND
IC13 = TPS65987DDHRSHR: USB Type-C™ and USB PD controller with integrated power switches 56-VQFN -10 to 75; Part Number: IC0052; Manufacturer: Texas Instruments; ID: 52; Operating Supply Current: 8mA; ManfactPart: TPS65987DDHRSHR; Supplier 1: Digi-Key; Manufacturer Part Number: TPS65987DDHRSHR; RoHS: Yes; Category: Power Management ICs; Stock 1: 6720; Pricing 1: 1=4.92000, 10=4.41700, 25=4.17600, 100=3.61930, 250=3.43372, 500=3.08106, 1000=2.62650 (USD); Mount: Surface Mount; Case/Package: VQFN; Min Operating Temperature: -10°C; Max Operating Temperature: 75°C; Packaging: Tape and Reel; RoHS Compliant: Yes; ComponentLink1URL: http://www.ti.com/lit/ds/symlink/tps65987d.pdf?src-supplier=Digi-Key; ComponentLink1Description: http://www.ti.com/lit/ds/symlink/tps65987d.pdf?src-supplier=Digi-Key; ComponentLink2URL: http://www.ti.com/general/docs/suppproductinfo.tsp?distId=10&amp;gotoUrl=http%3A%2F%2Fwww.ti.com%2Flit%2Fgpn%2Ftps65987d&src-supplier=Digi-Key; ComponentLink2Description: http://www.ti.com/general/docs/suppproductinfo.tsp?distId=10&amp;gotoUrl=http%3A%2F%2Fwww.ti.com%2Flit%2Fgpn%2Ftps65987d&src-supplier=Digi-Key; RefVal: TPS65987D; Supplier Part Number 1: 296-52067-1-ND
J4 = PLS-3: Board to Board Connector Straight Header Single Row 3 Position 2.54mm Pitch Through Hole Bag; Manufacturer: Amphenol; Manufacturer Part Number: G800W305018EU; Supplier 1: Mouser; RoHS: Yes; Category: Connectors; Stock 1: 26660; Pricing 1: 1=0.10000, 10=0.04200, 50=0.04200, 100=0.04000, 1000=0.03500, 10000=0.03000 (USD); Supplier Part Number 1: 523-G800W305018EU
R44 R192 = CRCW04022M00FKEDC: RES SMD 2M ohm 1% 1/16W R0402; Manufacturer: Vishay; check: ok; Manufacturer Part Number: CRCW04022M00FKEDC; Value: 2M; Power (Watts): 1/16W; Package / Case: 0402; Tolerance: ±1%
R72-R77 R184 R185 R188 R189 R196 = CRCW04020000Z0: RES SMD 0 ohm 1/16W R0402; Manufacturer: Vishay Dale; Manufacturer Part Number: CRCW04020000Z0; Value: 0; Power (Watts): 1/16W; Package / Case: 0402
R78-R93 = CRCW04021K00FKEDC: RES SMD 1K ohm 1% 1/16W R0402; Manufacturer: Vishay; check: ok; Manufacturer Part Number: CRCW04021K00FKEDC; Value: 1K; Power (Watts): 1/16W; Package / Case: 0402; Tolerance: ±1%
R94 R99 R101 R194 R199 = CRCW040210K0FK: RES SMD 10K ohm 1% 1/16W R0402; Manufacturer: Vishay; check: ok; Manufacturer Part Number: CRCW040210K0FK; Value: 10K; Power (Watts): 1/16W; Package / Case: 0402; Tolerance: ±1%
R95 R96 R100 R195 = CRCW0402100KFKEDC: RES SMD 100K ohm 1% 1/16W R0402; Manufacturer: Vishay; check: ok; Manufacturer Part Number: CRCW0402100KFKEDC; Value: 100K; Power (Watts): 1/16W; Package / Case: 0402; Tolerance: ±1%
R98 R144 R179 R198 R200 R201 = CRCW04022K20FK: RES SMD 2.2K ohm 1% 1/16W R0402; Manufacturer: Vishay; check: ok; Manufacturer Part Number: CRCW04022K20FK; Value: 2.2K; Power (Watts): 1/16W; Package / Case: 0402; Tolerance: ±1%
R102 R103 R105 R112 R193 = CRCW040210K0FK: RES SMD 10K ohm 1% 1/16W R0402; Manufacturer: Vishay Dale; Manufacturer Part Number: CRCW040210K0FK; Value: 10K; Power (Watts): 1/16W; Package / Case: 0402; Tolerance: ±1%
X5 = PBD-6: Conn Unshrouded Header HDR 6 POS 2.54mm Solder ST Thru-Hole Poly Bag; Manufacturer: Amphenol ICC / FCI; Manufacturer Part Number: 10076801-101-06LF; LatestRevisionDate: 17-Jul-2002; LatestRevisionNote: Re-released for DXP Platform.; Publisher: Altium Limited; Supplier 1: Mouser; RoHS: Yes; Category: Headers and Wire Housings; Stock 1: 1821; Pricing 1: 1=0.75000, 10=0.63400, 50=0.63400, 100=0.56500, 1000=0.41000, 10000=0.34100 (USD); ComponentLink1URL: https://datasheet.ciiva.com/9472/10076801-9472106.pdf?src-supplier=Avnet; ComponentLink1Description: https://datasheet.ciiva.com/9472/10076801-9472106.pdf?src-supplier=Avnet; Supplier Part Number 1: 649-1007680110106LF

## Sheet 10_EEPROM.SchDoc: Power and Incoming USB
size A2; Organization: Greenfield Tech Solutions; Address1: Molendreef 33; Address2: Ossendrecht; Address3: 4641CS; Address4: The Netherlands; Revision: 1.1; SheetNumber: 10; SheetTotal: 10
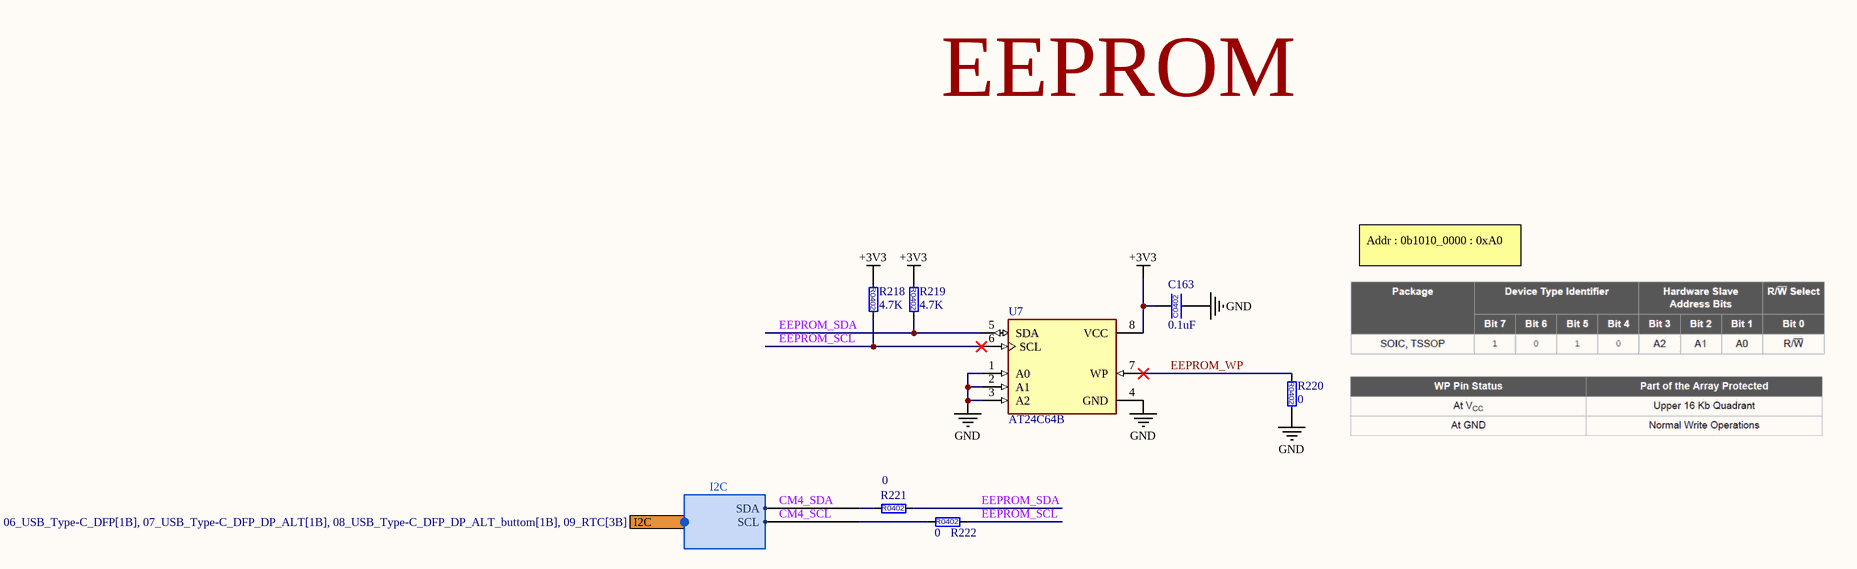
[diagram p14: 10_EEPROM.SchDoc]

### Parts
C163  0.1uF  [C0402]
R218  4.7K  [R0402]
R219  4.7K  [R0402]
R220  0  [R0402]
R221  0  [R0402]
R222  0  [R0402]
U7  AT24C64B  [AT24C64B_SOIC_8]

### Ports
I2C (harness I2C, see 01_Top[3B], 03_RPiCM4[1A], 05_HDMI_to_DP[1B], 06_USB_Type-C_DFP[1B], 07_USB_Type-C_DFP_DP_ALT[1B], 08_USB_Type-C_DFP_DP_ALT_buttom[1B], 09_RTC[3B])

### Harnesses
I2C: SDA, SCL

### Nets
+3V3: C163.1 R218.1 R219.1 U7.8(VCC)
GND: C163.2 R220.2 U7.1(A0) U7.2(A1) U7.3(A2) U7.4(GND)
CM4_SCL: R222.1 ; port I2C.SCL  [project net CM4_I2C.SCL]
CM4_SDA: R221.1 ; port I2C.SDA  [project net CM4_I2C.SDA]
EEPROM_SCL: R218.2 R222.2 U7.6(SCL)
EEPROM_SDA: R219.2 R221.2 U7.5(SDA)
EEPROM_WP: R220.1 U7.7(WP)

### Notes on the sheet
- EEPROM
- Addr : 0b1010_0000 : 0xA0
- Title
- Size:
- Date:
- File:
- A2
- Number:
- Time:
- Revision:
- Sheet
- of
- (in symbol 04023D104KAT2A) C0402
- (in symbol CRCW04024K7FK) R0402
- (in symbol CRCW04020000Z0) R0402

### Library data of the parts
C163 = 04023D104KAT2A: as C10-C12 on sheet 04_PCIe_VL805; Manufacturer Part Number: 04023D104KAT2A; Value: 0.1uF; Voltage - Rated: 25V; Tolerance: ±10%; Temperature Coefficient: X5R
R218 R219 = CRCW04024K7FK: RES SMD 4.7K ohm 1% 1/16W R0402; Manufacturer: Vishay Dale; Manufacturer Part Number: CRCW04024K7FK; Value: 4.7K; Power (Watts): 1/16W; Package / Case: 0805 (2012 Metric); Tolerance: ±1%
R220-R222 = CRCW04020000Z0: as R72 on sheet 07_USB_Type-C_DFP_DP_ALT; Manufacturer Part Number: CRCW04020000Z0; Value: 0; Power (Watts): 1/16W; Package / Case: 0402
U7 = AT24C64B: IC EEPROM 64K I2C 400KHZ 8SOIC; Manufacturer: Microchip; Manufacturer Part Number: AT24C64BN-10SU-2.7; Supplier 1: Digi-Key; RoHS: Yes; Category: EEPROM; Stock 1: 32; Pricing 1: 1=0.76000 (USD); Supplier Part Number 1: AT24C64BN-10SU-2.7-ND

## Sheet 09_RTC.SchDoc: Power and Incoming USB
size A2; Organization: Greenfield Tech Solutions; Address1: Molendreef 33; Address2: Ossendrecht; Address3: 4641CS; Address4: The Netherlands; Revision: 1.1; SheetNumber: 9; SheetTotal: 11
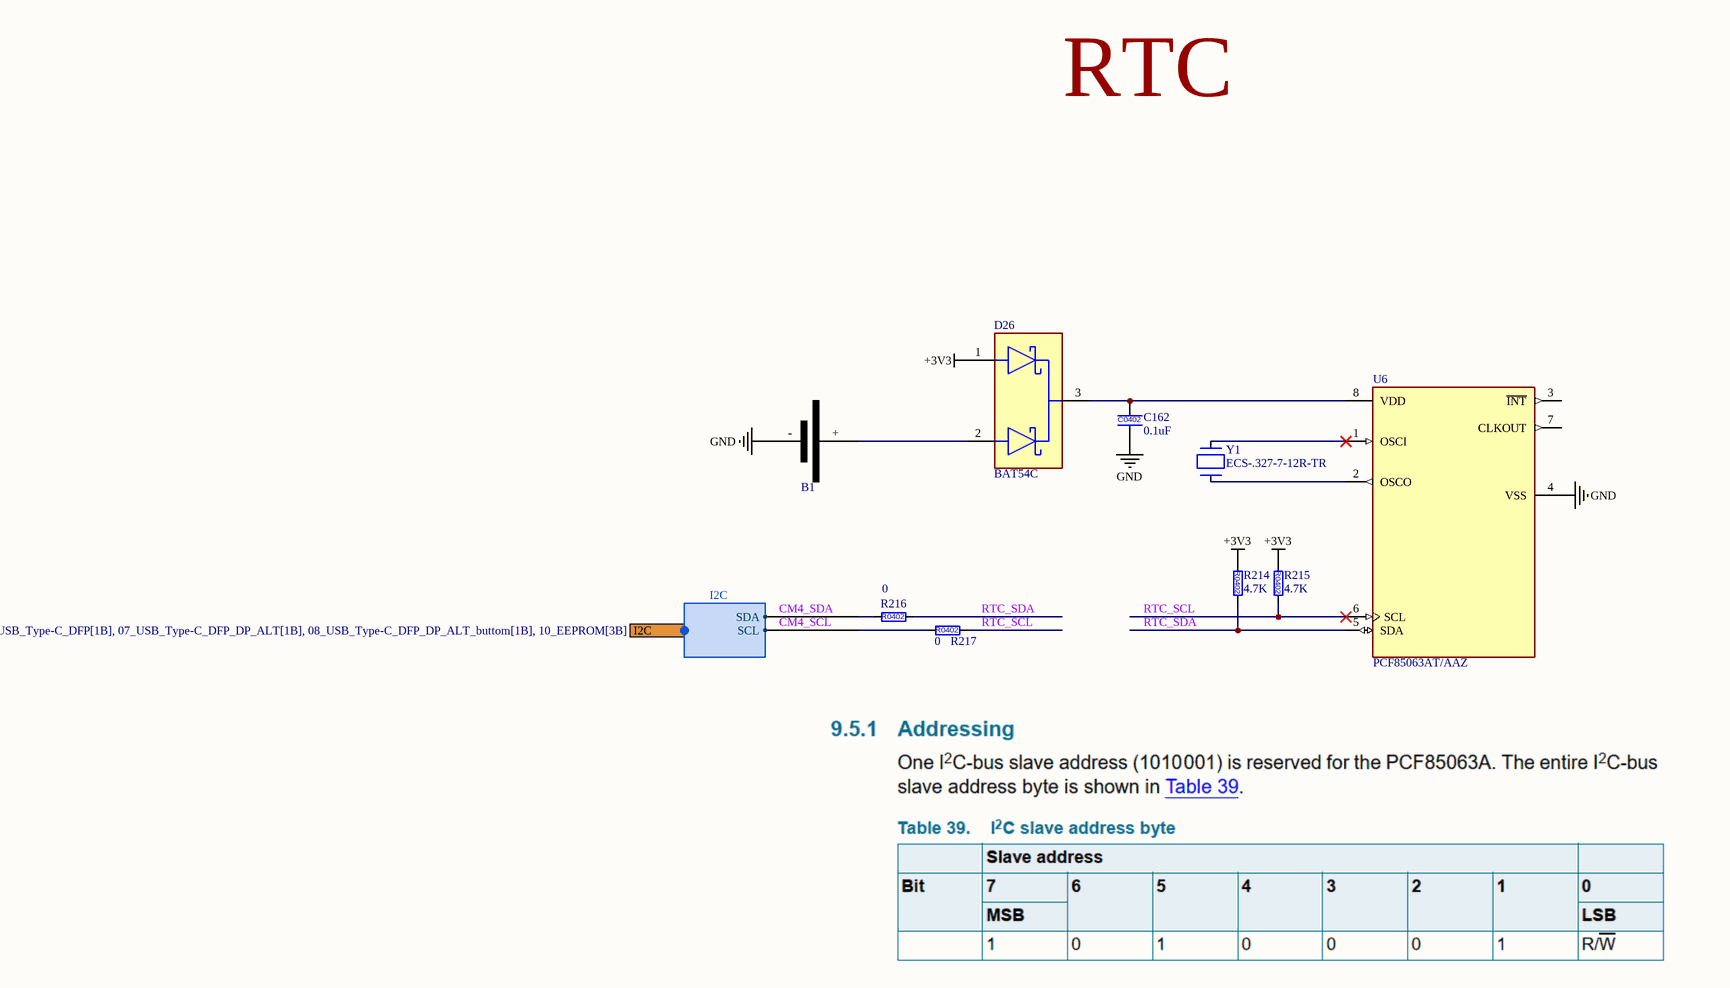
[diagram p15: 09_RTC.SchDoc]

### Parts
B1  BATTERY HOLDER CR1220  [BC501SM_CR1220]  (value not drawn)
C162  0.1uF  [C0402]
D26  BAT54C  [BAT54C_SOT_23_3]
R214  4.7K  [R0402]
R215  4.7K  [R0402]
R216  0  [R0402]
R217  0  [R0402]
U6  PCF85063AT/AAZ  [PCF85063AT_SOIC_8]
Y1  ECS-.327-7-12R-TR  [FP-ECX-12R-MFG]

### Ports
I2C (harness I2C, see 01_Top[3B], 03_RPiCM4[1B], 05_HDMI_to_DP[1B], 06_USB_Type-C_DFP[1B], 07_USB_Type-C_DFP_DP_ALT[1B], 08_USB_Type-C_DFP_DP_ALT_buttom[1B], 10_EEPROM[3B])

### Harnesses
I2C: SDA, SCL

### Nets
+3V3: D26.1(1_ANODE) R214.1 R215.1
GND: B1.- C162.2 U6.4(VSS)
CM4_SCL: R217.1 ; port I2C.SCL  [project net CM4_I2C.SCL]
CM4_SDA: R216.1 ; port I2C.SDA  [project net CM4_I2C.SDA]
RTC_SCL: R215.2 R217.2 U6.6(SCL)
RTC_SDA: R214.2 R216.2 U6.5(SDA)
NetB1_+: B1.+ D26.2(2_ANODE)
NetC162_1: C162.1 D26.3(COMMON_CATHODE) U6.8(VDD)
NetU6_1: U6.1(OSCI) Y1.1(In/Out)
NetU6_2: U6.2(OSCO) Y1.2(Out/In)

Not connected (* = marked no-connect by the designer): U6 3(~{INT}) 7(CLKOUT)

### Notes on the sheet
- RTC
- Title
- Size:
- Date:
- File:
- A2
- Number:
- Time:
- Revision:
- Sheet
- of
- (in symbol 04023D104KAT2A) C0402
- (in symbol CRCW04024K7FK) R0402
- (in symbol CRCW04020000Z0) R0402

### Library data of the parts
B1 = BC501SM: BATTERY HOLDER COIN 12MM SMD; Manufacturer: Memory Protection Devices; Number of Cells: 1; Supplier 1: Digi-Key; Manufacturer Part Number: BC501SM; RoHS: Yes; Category: Uncategorized; Stock 1: 4069; Pricing 1: 1=1.03000, 10=0.87200, 50=0.76400, 100=0.72030, 250=0.66312, 500=0.62272, 1000=0.58232, 2500=0.53183, 5000=0.49144 (USD); Mount: Surface Mount,PCB; Case/Package: SMD/SMT; Min Operating Temperature: -40°C; Max Operating Temperature: 85°C; Package Quantity: 200; Termination: SMD/SMT; ComponentLink1URL: https://datasheet.ciiva.com/4/bc501sm-datasheet-4073.pdf?src-supplier=Digi-Key; ComponentLink1Description: https://datasheet.ciiva.com/4/bc501sm-datasheet-4073.pdf?src-supplier=Digi-Key; Supplier Part Number 1: BC501SM-ND
C162 = 04023D104KAT2A: as C10-C12 on sheet 04_PCIe_VL805; Manufacturer Part Number: 04023D104KAT2A; Value: 0.1uF; Voltage - Rated: 25V; Tolerance: ±10%; Temperature Coefficient: X5R
D26 = BAT54C: BAT54 Series 30 V 200 mA Surface Mount Schottky Barrier Double Diode - SOT-23; Obsolete Part: true; Manufacturer: ON Semiconductor; Max Repetitive Reverse Voltage: 30V; Max Junction Temp: +150°C; Forward Current: 200mA; Peak Reverse Current: 2uA; Standoff Height: 0mm; Capacitance: 10pF; Max Surge Forward Current: 600mA; Value: 10pF; Element Configuration: Common Cathode; Forward Voltage: 800mV; Reverse Recovery Time: 5ns; Power Dissipation: 290mW; Current Rating: 200A; Device Class L3: Schottky Diodes; ComponentLink2Description: Datasheet; Category: Diode; ComponentLink2URL: https://media.digikey.com/pdf/Data%20Sheets/ON%20Semiconductor%20PDFs/BAT54(A,C,S).pdf; Package: MA03D; Octopart: https://octopart.com/bat54c-on+semiconductor-8095621; Height: 1.2mm; Reverse Voltage: 30V; Manufacturer Part Number: BAT54C; Automotive: No; Device Class L1: Discrete Semiconductors; Temperature Range Low: -55°C; Device Class L2: Diodes; Digikey Description: DIODE ARRAY SCHOTTKY 30V SOT23-3; Temperature: -55°C to +150°C; Temperature Range High: +150°C; Supplier 1: Farnell; RoHS: Yes; Pricing 1: 5=0.05820, 50=0.04540, 100=0.04420, 500=0.03510, 1500=0.03100 (EUR); Mount: Surface Mount; Case/Package: SOT-23; Number of Pins: 3; Contact Plating: Tin,Matte; Weight: 0.000882oz; Min Operating Temperature: -55°C; Max Operating Temperature: 150°C; Packaging: Cut Tape; Max Repetitive Reverse Voltage (Vrrm): 30V; Max Forward Surge Current (Ifsm): 600mA; Package Quantity: 1; Max Reverse Current: 2uA; Average Rectified Current: 200mA; Peak Non-Repetitive Surge Current: 600mA; Voltage Rating (DC): 30V; Max Reverse Voltage (DC): 30V; Series: -; Voltage: 30V; Length: 2.92mm; Width: 1.3mm; Radiation Hardening: No; RoHS Compliant: Yes; Lead Free: Lead Free; Reach SVHC Compliant: Yes; ComponentLink1URL: https://datasheet.ciiva.com/22651/1923830-22651948.pdf?src-supplier=Element14; ComponentLink1Description: https://datasheet.ciiva.com/22651/1923830-22651948.pdf?src-supplier=Element14; ComponentLink3URL: https://datasheet.ciiva.com/904/bat54-904342.pdf?src-supplier=Digi-Key; ComponentLink3Description: https://datasheet.ciiva.com/904/bat54-904342.pdf?src-supplier=Digi-Key; ComponentLink4URL: https://datasheet.ciiva.com/904/bat54-904343.pdf?src-supplier=Digi-Key; ComponentLink4Description: https://datasheet.ciiva.com/904/bat54-904343.pdf?src-supplier=Digi-Key; ComponentLink5URL: https://datasheet.ciiva.com/904/bat54-904341.pdf?src-supplier=Digi-Key; ComponentLink5Description: https://datasheet.ciiva.com/904/bat54-904341.pdf?src-supplier=Digi-Key; Supplier Part Number 1: 1467518
R214 R215 = CRCW04024K7FK: as R218 on sheet 10_EEPROM; Manufacturer Part Number: CRCW04024K7FK; Value: 4.7K; Power (Watts): 1/16W; Package / Case: 0805 (2012 Metric); Tolerance: ±1%
R216 R217 = CRCW04020000Z0: as R72 on sheet 07_USB_Type-C_DFP_DP_ALT; Manufacturer Part Number: CRCW04020000Z0; Value: 0; Power (Watts): 1/16W; Package / Case: 0402
U6 = PCF85063AT: PCF85063AT: 5.5 V Tiny Real-Time Clock/Calendar w/Alarm Function and I2C-bus; Manufacturer: NXP Semiconductors; Interface: I2C; Date Format: YY-MM-DD-dd; Time Format: HH:MM:SS (12/24 hr); RoHS Compliant: Yes; Mount: Surface Mount; Min Operating Temperature: -40°C; Lead Free: Lead Free; Packaging: Tape and Reel; Max Operating Temperature: 85°C; Case/Package: SOIC; Supplier 1: Mouser; Manufacturer Part Number: PCF85063AT/AAZ; RoHS: Yes; Category: Real Time Clocks; Stock 1: 46938; Pricing 1: 1=0.81000, 10=0.75400, 50=0.72800, 100=0.64200, 1000=0.49700, 10000=0.48900 (USD); ComponentLink1URL: http://www.farnell.com/datasheets/2617867.pdf?src-supplier=Farnell; ComponentLink1Description: http://www.farnell.com/datasheets/2617867.pdf?src-supplier=Farnell; ComponentLink2URL: http://www.nxp.com/documents/data_sheet/PCF85063A.pdf?src-supplier=Avnet; ComponentLink2Description: http://www.nxp.com/documents/data_sheet/PCF85063A.pdf?src-supplier=Avnet; Supplier Part Number 1: 771-PCF85063AT/AAZ
Y1 = ECS-.327-7-12R-TR: Crystal 0.032768MHz ±20ppm (Tol) 7pF Flexural 70000Ohm Automotive 2-Pin Ultra Mini-CSMD T/R; Manufacturer: ECS International; Supplier 1: Digi-Key; Manufacturer Part Number: ECS-.327-7-12R-TR; RoHS: Yes; Category: Crystals; Stock 1: 130928; Pricing 1: 1=0.79000, 10=0.69700, 50=0.65140, 100=0.57570, 500=0.54540, 1000=0.45450 (USD); ComponentLink1URL: https://www.ecsxtal.com/store/pdf/ECX-12R.pdf?src-supplier=Digi-Key; ComponentLink1Description: https://www.ecsxtal.com/store/pdf/ECX-12R.pdf?src-supplier=Digi-Key; Supplier Part Number 1: XC2743CT-ND

## Sheet 11_Revision.SchDoc: Power and Incoming USB
size 558 x 431 mm; Organization: Greenfield Tech Solutions; Address1: Molendreef 33; Address2: Ossendrecht; Address3: 4641CS; Address4: The Netherlands; Revision: 1.1; SheetNumber: 11; SheetTotal: 11
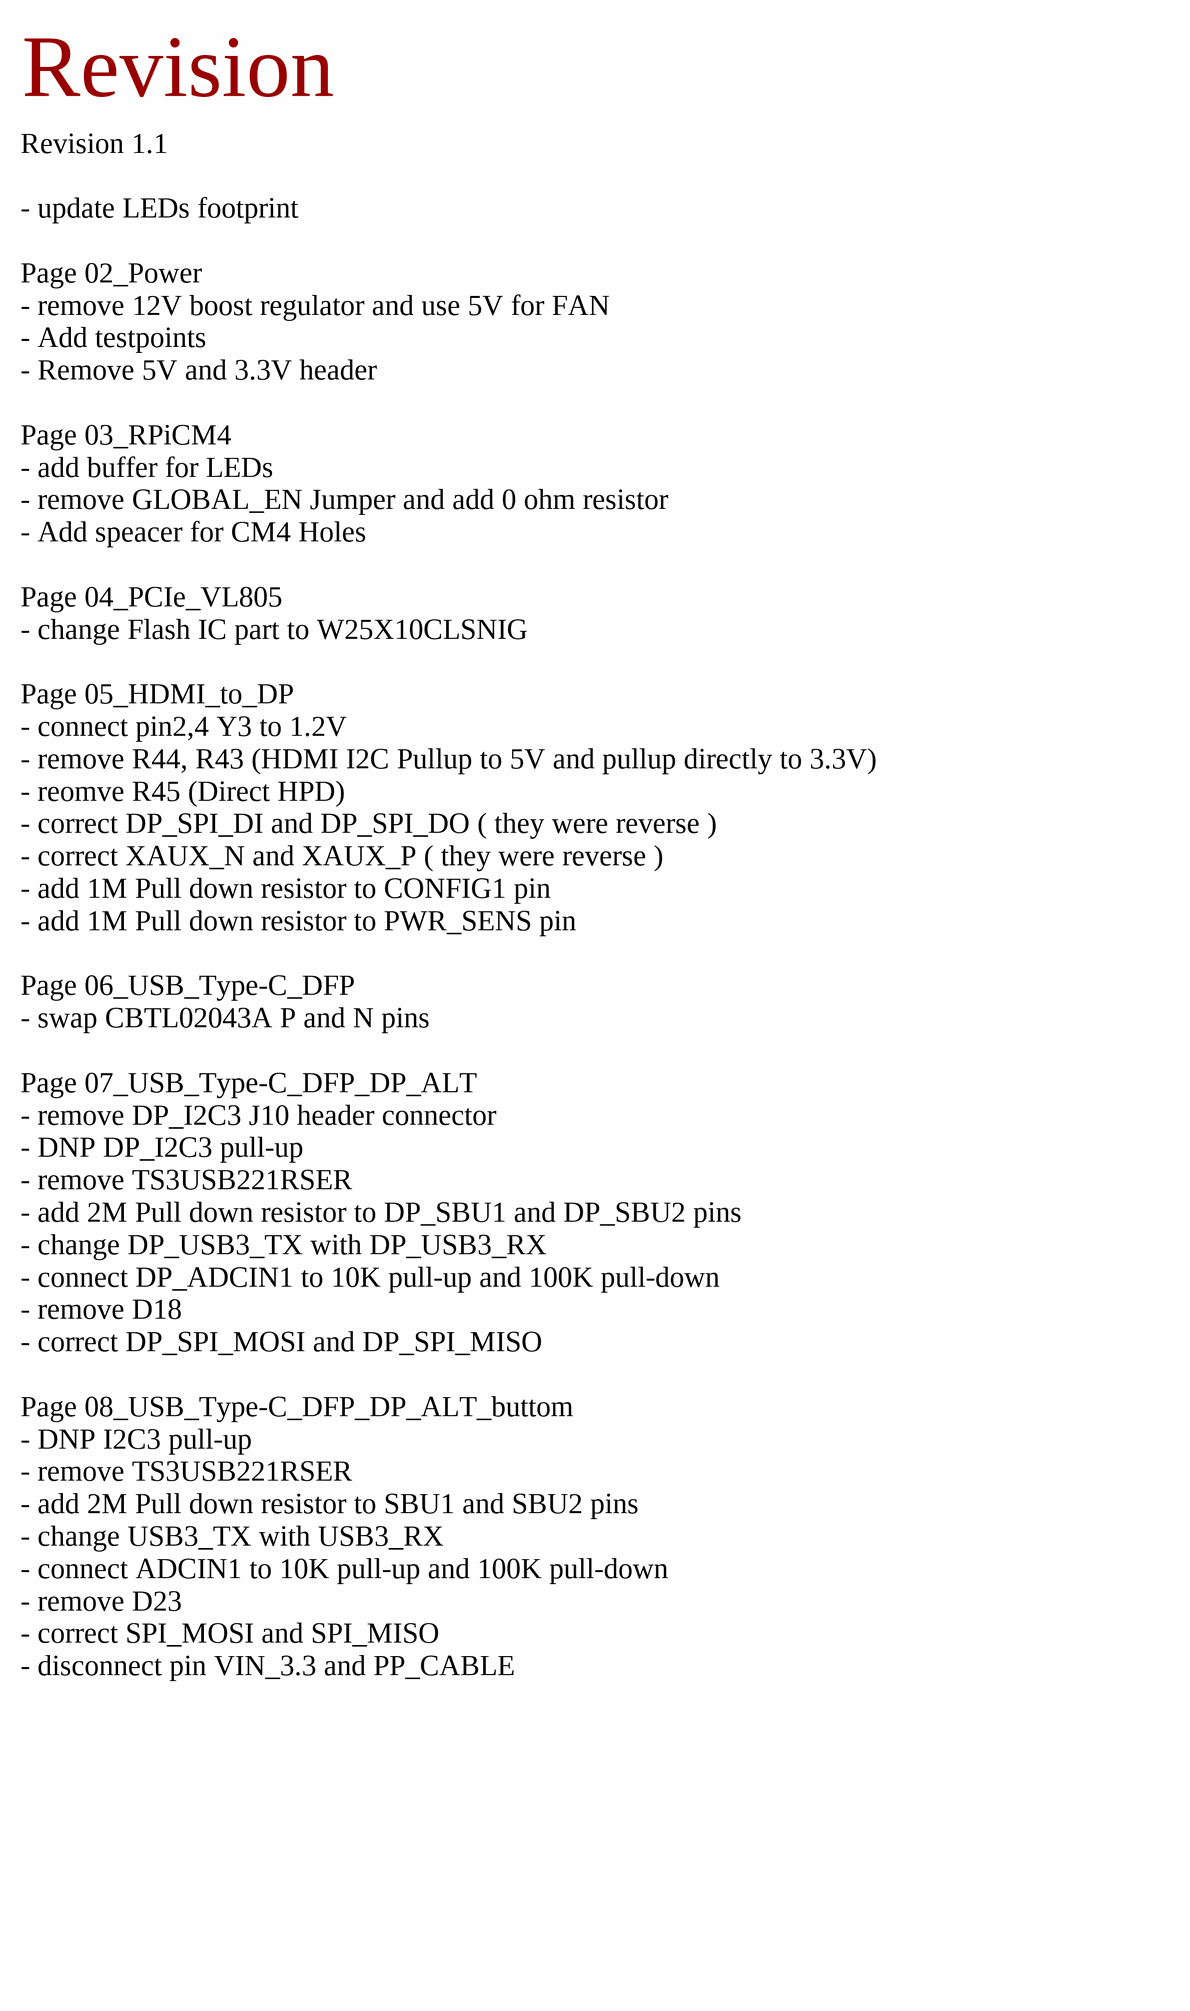
[diagram p16: 11_Revision.SchDoc]

### Notes on the sheet
- Revision
- Revision 1.1
  - update LEDs footprint
  Page 02_Power
  - remove 12V boost regulator and use 5V for FAN
  - Add testpoints
  - Remove 5V and 3.3V header
  Page 03_RPiCM4
  - add buffer for LEDs
  - remove GLOBAL_EN Jumper and add 0 ohm resistor
  - Add speacer for CM4 Holes
  Page 04_PCIe_VL805
  - change Flash IC part to W25X10CLSNIG
  Page 05_HDMI_to_DP
  - connect pin2,4 Y3 to 1.2V
  - remove R44, R43 (HDMI I2C Pullup to 5V and pullup directly to 3.3V)
  - reomve R45 (Direct HPD)
  - correct DP_SPI_DI and DP_SPI_DO ( they were reverse )
  - correct XAUX_N and XAUX_P ( they were reverse )
  - add 1M Pull down resistor to CONFIG1 pin
  - add 1M Pull down resistor to PWR_SENS pin
  Page 06_USB_Type-C_DFP
  - swap CBTL02043A P and N pins
  Page 07_USB_Type-C_DFP_DP_ALT
  - remove DP_I2C3 J10 header connector
  - DNP DP_I2C3 pull-up
  - remove TS3USB221RSER
  - add 2M Pull down resistor to DP_SBU1 and DP_SBU2 pins
  - change DP_USB3_TX with DP_USB3_RX
  - connect DP_ADCIN1 to 10K pull-up and 100K pull-down
  - remove D18
  - correct DP_SPI_MOSI and DP_SPI_MISO
  Page 08_USB_Type-C_DFP_DP_ALT_buttom
  - DNP I2C3 pull-up
  - remove TS3USB221RSER
  - add 2M Pull down resistor to SBU1 and SBU2 pins
  - change USB3_TX with USB3_RX
  - connect ADCIN1 to 10K pull-up and 100K pull-down
  - remove D23
  - correct SPI_MOSI and SPI_MISO
  - disconnect pin VIN_3.3 and PP_CABLE
- DWG. NO.
- REV.
- SHT.
- REVISION
- DESCRIPTION
- DATE
- APPROVED
- THIS DOCUMENT AND THE DATA DISCLOSED HEREIN OR HEREWITH IS THE PROPERTY OF ALTIUM LIMITED AND MAY BE FREELY DISTRIBUTED IN WHOLE. NO RIGHTS ARE RESERVED OR EXPRESS OR IMPLIED WARANTEE GIVEN.
- ENG:
- DSN:
- APPROVALS
- PROJECT
- DOCUMENT REVISION:
- DESIGN ITEM:
- CHK:
- BOM:
- REFERENCE DOCUMENTS
- PROJECT REVISION:
- TITLE
- FAB DWG:
- PCB DWG:
- ASSY DWG:
- SCALE:
- SIZE
- C
- CAGE CODE
- FILE NAME
- DWG NO.
- SHEET
- OF
- REV

## Nets that join several sheets
+1V2: 02_Power (6 pins), HDMI_to_DP_0 (29 pins), HDMI_to_DP_1 (29 pins)
+1V05: 02_Power (6 pins), 04_PCIe_VL805 (18 pins)
+1V8: 02_Power (C166.1 U3.5), USB_Type-C_DFP_0 (8 pins), USB_Type-C_DFP_1 (8 pins)
+3V3: 08_USB_Type-C_DFP_DP_ALT_buttom (16 pins), 02_Power (11 pins), 03_RPiCM4 (16 pins), USB_Type-C_DFP_0 (C155.1.1 IC3.1.32), USB_Type-C_DFP_1 (C155.2.1 IC3.2.32), 04_PCIe_VL805 (29 pins), HDMI_to_DP_0 (37 pins), 07_USB_Type-C_DFP_DP_ALT (18 pins), HDMI_to_DP_1 (37 pins), 10_EEPROM (C163.1 R218.1 R219.1 U7.8), 09_RTC (D26.1 R214.1 R215.1)
+5V: 02_Power (12 pins), 03_RPiCM4 (13 pins), USB_Type-C_DFP_0 (C127.1.1 IC3.1.28 IC3.1.29), USB_Type-C_DFP_1 (C127.2.1 IC3.2.28 IC3.2.29), HDMI_to_DP_0 (R29.1.1), 07_USB_Type-C_DFP_DP_ALT (6 pins), HDMI_to_DP_1 (R29.2.1)
GND: 01_Top (H1.1 H2.1 H3.1 H4.1), 08_USB_Type-C_DFP_DP_ALT_buttom (54 pins), 02_Power (38 pins), 03_RPiCM4 (87 pins), USB_Type-C_DFP_0 (42 pins), USB_Type-C_DFP_1 (42 pins), 04_PCIe_VL805 (30 pins), HDMI_to_DP_0 (57 pins), 07_USB_Type-C_DFP_DP_ALT (55 pins), HDMI_to_DP_1 (57 pins), 10_EEPROM (6 pins), 09_RTC (B1.- C162.2 U6.4)
VPWR: 08_USB_Type-C_DFP_DP_ALT_buttom (6 pins), 02_Power (8 pins)
AUX_N: 08_USB_Type-C_DFP_DP_ALT_buttom (IC14.25), HDMI_to_DP_0 (C115.1.1 R31.1.1)
AUX_N: 07_USB_Type-C_DFP_DP_ALT (IC4.25), HDMI_to_DP_1 (C115.2.1 R31.2.1)
AUX_P: 08_USB_Type-C_DFP_DP_ALT_buttom (IC14.24), HDMI_to_DP_0 (C116.1.1 R33.1.1)
AUX_P: 07_USB_Type-C_DFP_DP_ALT (IC4.24), HDMI_to_DP_1 (C116.2.1 R33.2.1)
CLK_N: 03_RPiCM4 (J6.112), 04_PCIe_VL805 (R136.1)
CLK_P: 03_RPiCM4 (J6.110), 04_PCIe_VL805 (R135.1)
CM4_I2C.SCL: 08_USB_Type-C_DFP_DP_ALT_buttom (R191.1), 03_RPiCM4 (IC7.2 J5.80 R118.2 R209.2), USB_Type-C_DFP_0 (R128.1.1), USB_Type-C_DFP_1 (R128.2.1), HDMI_to_DP_0 (R149.1.1), 07_USB_Type-C_DFP_DP_ALT (R189.1), HDMI_to_DP_1 (R149.2.1), 10_EEPROM (R222.1), 09_RTC (R217.1)
CM4_I2C.SDA: 08_USB_Type-C_DFP_DP_ALT_buttom (R190.1), 03_RPiCM4 (IC7.1 J5.82 R117.2 R208.2), USB_Type-C_DFP_0 (R127.1.1), USB_Type-C_DFP_1 (R127.2.1), HDMI_to_DP_0 (R148.1.1), 07_USB_Type-C_DFP_DP_ALT (R188.1), HDMI_to_DP_1 (R148.2.1), 10_EEPROM (R221.1), 09_RTC (R216.1)
CM4_rstn: 03_RPiCM4 (J5.100), 04_PCIe_VL805 (R22.1), HDMI_to_DP_0 (R28.1.1), HDMI_to_DP_1 (R28.2.1)
D_DFP_N: USB_Type-C_DFP_0 (CO4.1.7 CO4.1.27 D4.1.2 R64.1.2), 04_PCIe_VL805 (IC11.17)
D_DFP_N: USB_Type-C_DFP_1 (CO4.2.7 CO4.2.27 D4.2.2 R64.2.2), 04_PCIe_VL805 (IC11.8)
D_DFP_P: USB_Type-C_DFP_0 (CO4.1.6 CO4.1.26 D4.1.1 R65.1.2), 04_PCIe_VL805 (IC11.16)
D_DFP_P: USB_Type-C_DFP_1 (CO4.2.6 CO4.2.26 D4.2.1 R65.2.2), 04_PCIe_VL805 (IC11.7)
D_N: 08_USB_Type-C_DFP_DP_ALT_buttom (CO5.7 CO5.27 D19.2 R187.2), 04_PCIe_VL805 (IC11.59)
D_P: 08_USB_Type-C_DFP_DP_ALT_buttom (CO5.6 CO5.26 D19.1 R186.2), 04_PCIe_VL805 (IC11.58)
DP0_N: 08_USB_Type-C_DFP_DP_ALT_buttom (IC14.10), HDMI_to_DP_0 (C124.1.1)
DP0_N: 07_USB_Type-C_DFP_DP_ALT (IC4.10), HDMI_to_DP_1 (C124.2.1)
DP0_P: 08_USB_Type-C_DFP_DP_ALT_buttom (IC14.9), HDMI_to_DP_0 (C125.1.1)
DP0_P: 07_USB_Type-C_DFP_DP_ALT (IC4.9), HDMI_to_DP_1 (C125.2.1)
DP1_N: 08_USB_Type-C_DFP_DP_ALT_buttom (IC14.13), HDMI_to_DP_0 (C122.1.1)
DP1_N: 07_USB_Type-C_DFP_DP_ALT (IC4.13), HDMI_to_DP_1 (C122.2.1)
DP1_P: 08_USB_Type-C_DFP_DP_ALT_buttom (IC14.12), HDMI_to_DP_0 (C123.1.1)
DP1_P: 07_USB_Type-C_DFP_DP_ALT (IC4.12), HDMI_to_DP_1 (C123.2.1)
DP2_N: 08_USB_Type-C_DFP_DP_ALT_buttom (IC14.16), HDMI_to_DP_0 (C120.1.1)
DP2_N: 07_USB_Type-C_DFP_DP_ALT (IC4.16), HDMI_to_DP_1 (C120.2.1)
DP2_P: 08_USB_Type-C_DFP_DP_ALT_buttom (IC14.15), HDMI_to_DP_0 (C121.1.1)
DP2_P: 07_USB_Type-C_DFP_DP_ALT (IC4.15), HDMI_to_DP_1 (C121.2.1)
DP3_N: 08_USB_Type-C_DFP_DP_ALT_buttom (IC14.19), HDMI_to_DP_0 (C118.1.1)
DP3_N: 07_USB_Type-C_DFP_DP_ALT (IC4.19), HDMI_to_DP_1 (C118.2.1)
DP3_P: 08_USB_Type-C_DFP_DP_ALT_buttom (IC14.18), HDMI_to_DP_0 (C119.1.1)
DP3_P: 07_USB_Type-C_DFP_DP_ALT (IC4.18), HDMI_to_DP_1 (C119.2.1)
DP_D_N: 04_PCIe_VL805 (IC11.68), 07_USB_Type-C_DFP_DP_ALT (CO1.7 CO1.27 D6.2 R185.2)
DP_D_P: 04_PCIe_VL805 (IC11.67), 07_USB_Type-C_DFP_DP_ALT (CO1.6 CO1.26 D6.1 R184.2)
DP_HPD: 08_USB_Type-C_DFP_DP_ALT_buttom (IC14.32 IC15.30 R155.1), HDMI_to_DP_0 (IC2.1.G1 R34.1.2)
DP_HPD: 07_USB_Type-C_DFP_DP_ALT (IC4.32 IC13.30 R77.1), HDMI_to_DP_1 (IC2.2.G1 R34.2.2)
DP_USB3_RX_N: 04_PCIe_VL805 (IC11.65), 07_USB_Type-C_DFP_DP_ALT (C43.2)
DP_USB3_RX_P: 04_PCIe_VL805 (IC11.64), 07_USB_Type-C_DFP_DP_ALT (C36.2)
DP_USB3_TX_N: 04_PCIe_VL805 (C84.1), 07_USB_Type-C_DFP_DP_ALT (IC4.7)
DP_USB3_TX_P: 04_PCIe_VL805 (C81.1), 07_USB_Type-C_DFP_DP_ALT (IC4.8)
HDMI0_CEC: 03_RPiCM4 (J6.151), HDMI_to_DP_0 (IC2.1.F9 R53.1.2)
HDMI0_CK_N: 03_RPiCM4 (J6.190), HDMI_to_DP_0 (IC2.1.A8)
HDMI0_CK_P: 03_RPiCM4 (J6.188), HDMI_to_DP_0 (IC2.1.A7)
HDMI0_HOT: 03_RPiCM4 (J6.153), HDMI_to_DP_0 (Q1.1.3 R29.1.2)
HDMI0_SCL: 03_RPiCM4 (J6.200 R119.2), HDMI_to_DP_0 (IC2.1.H2 R47.1.2)
HDMI0_SDA: 03_RPiCM4 (J6.199 R120.1), HDMI_to_DP_0 (IC2.1.G2 R48.1.2)
HDMI0_TD0_N: 03_RPiCM4 (J6.184), HDMI_to_DP_0 (IC2.1.A6)
HDMI0_TD0_P: 03_RPiCM4 (J6.182), HDMI_to_DP_0 (IC2.1.A5)
HDMI0_TD1_N: 03_RPiCM4 (J6.178), HDMI_to_DP_0 (IC2.1.A4)
HDMI0_TD1_P: 03_RPiCM4 (J6.176), HDMI_to_DP_0 (IC2.1.A3)
HDMI0_TD2_N: 03_RPiCM4 (J6.172), HDMI_to_DP_0 (IC2.1.A2)
HDMI0_TD2_P: 03_RPiCM4 (J6.170), HDMI_to_DP_0 (IC2.1.A1)
HDMI1_CEC: 03_RPiCM4 (J6.149), HDMI_to_DP_1 (IC2.2.F9 R53.2.2)
HDMI1_CK_N: 03_RPiCM4 (J6.166), HDMI_to_DP_1 (IC2.2.A8)
HDMI1_CK_P: 03_RPiCM4 (J6.164), HDMI_to_DP_1 (IC2.2.A7)
HDMI1_HOT: 03_RPiCM4 (J6.143), HDMI_to_DP_1 (Q1.2.3 R29.2.2)
HDMI1_SCL: 03_RPiCM4 (J6.147 R113.2), HDMI_to_DP_1 (IC2.2.H2 R47.2.2)
HDMI1_SDA: 03_RPiCM4 (J6.145 R21.2), HDMI_to_DP_1 (IC2.2.G2 R48.2.2)
HDMI1_TD0_N: 03_RPiCM4 (J6.160), HDMI_to_DP_1 (IC2.2.A6)
HDMI1_TD0_P: 03_RPiCM4 (J6.158), HDMI_to_DP_1 (IC2.2.A5)
HDMI1_TD1_N: 03_RPiCM4 (J6.154), HDMI_to_DP_1 (IC2.2.A4)
HDMI1_TD1_P: 03_RPiCM4 (J6.152), HDMI_to_DP_1 (IC2.2.A3)
HDMI1_TD2_N: 03_RPiCM4 (J6.148), HDMI_to_DP_1 (IC2.2.A2)
HDMI1_TD2_P: 03_RPiCM4 (J6.146), HDMI_to_DP_1 (IC2.2.A1)
PCIE_CLK_NREQ: 03_RPiCM4 (J6.102), 04_PCIe_VL805 (IC11.30)
PCIe_NRST: 03_RPiCM4 (J6.109), 04_PCIe_VL805 (IC11.19)
PCIE_RX_N: 03_RPiCM4 (J6.118), 04_PCIe_VL805 (C83.2)
PCIE_RX_P: 03_RPiCM4 (J6.116), 04_PCIe_VL805 (C82.2)
PCIE_TX_N: 03_RPiCM4 (J6.124), 04_PCIe_VL805 (IC11.28)
PCIE_TX_P: 03_RPiCM4 (J6.122), 04_PCIe_VL805 (IC11.27)
USB1_RX_N: 08_USB_Type-C_DFP_DP_ALT_buttom (C140.2), 04_PCIe_VL805 (IC11.56)
USB1_RX_P: 08_USB_Type-C_DFP_DP_ALT_buttom (C138.2), 04_PCIe_VL805 (IC11.55)
USB1_TX_N: 08_USB_Type-C_DFP_DP_ALT_buttom (IC14.7), 04_PCIe_VL805 (C80.1)
USB1_TX_P: 08_USB_Type-C_DFP_DP_ALT_buttom (IC14.8), 04_PCIe_VL805 (C79.1)
USB3_DFP_RX_N: USB_Type-C_DFP_0 (C30.1.2), 04_PCIe_VL805 (IC11.14)
USB3_DFP_RX_N: USB_Type-C_DFP_1 (C30.2.2), 04_PCIe_VL805 (IC11.5)
USB3_DFP_RX_P: USB_Type-C_DFP_0 (C24.1.2), 04_PCIe_VL805 (IC11.13)
USB3_DFP_RX_P: USB_Type-C_DFP_1 (C24.2.2), 04_PCIe_VL805 (IC11.4)
USB3_DFP_TX_N: USB_Type-C_DFP_0 (IC6.1.14), 04_PCIe_VL805 (C89.1)
USB3_DFP_TX_N: USB_Type-C_DFP_1 (IC6.2.14), 04_PCIe_VL805 (C86.1)
USB3_DFP_TX_P: USB_Type-C_DFP_0 (IC6.1.15), 04_PCIe_VL805 (C87.1)
USB3_DFP_TX_P: USB_Type-C_DFP_1 (IC6.2.15), 04_PCIe_VL805 (C85.1)

## Assembly variants
Prototype: not fitted J1 J3.1 J3.2 J4 J9 P1 P2 R6 R28.1 R28.2 R37.1 R37.2 R38.1 R38.2 R40.1 R40.2 R46.1 R46.2 R50.1 R50.2 R52.1 R52.2 R60.1 R60.2 R61.1 R61.2 R73 R75 R77 R78 R79 R80 R81 R82 R84 R85 R91 R96 R99 R101 R104.2 R122 R123 R124 R127.1 R127.1 R127.2 R127.2 R128.1 R128.1 R128.2 R128.2 R129.1 R129.2 R130.1 R130.2 R148.1 R148.2 R149.1 R149.2 R151 R153 R155 R156 R157 R158 R159 R160 R162 R163 R169 R177 R188 R189 R193 R199 R200 R201 R202 R203 R204 R205 R211 R223.1 R224 R225 R226 R227 R227 R228 R228 R231 R233 R234 R235 R236 R237.1 R237.2 R238.1 R238.2 R239.1 R239.2 R240.1 R240.2 X1 X2